# EAGLE design REV1 (EAGLE 9.6.2)
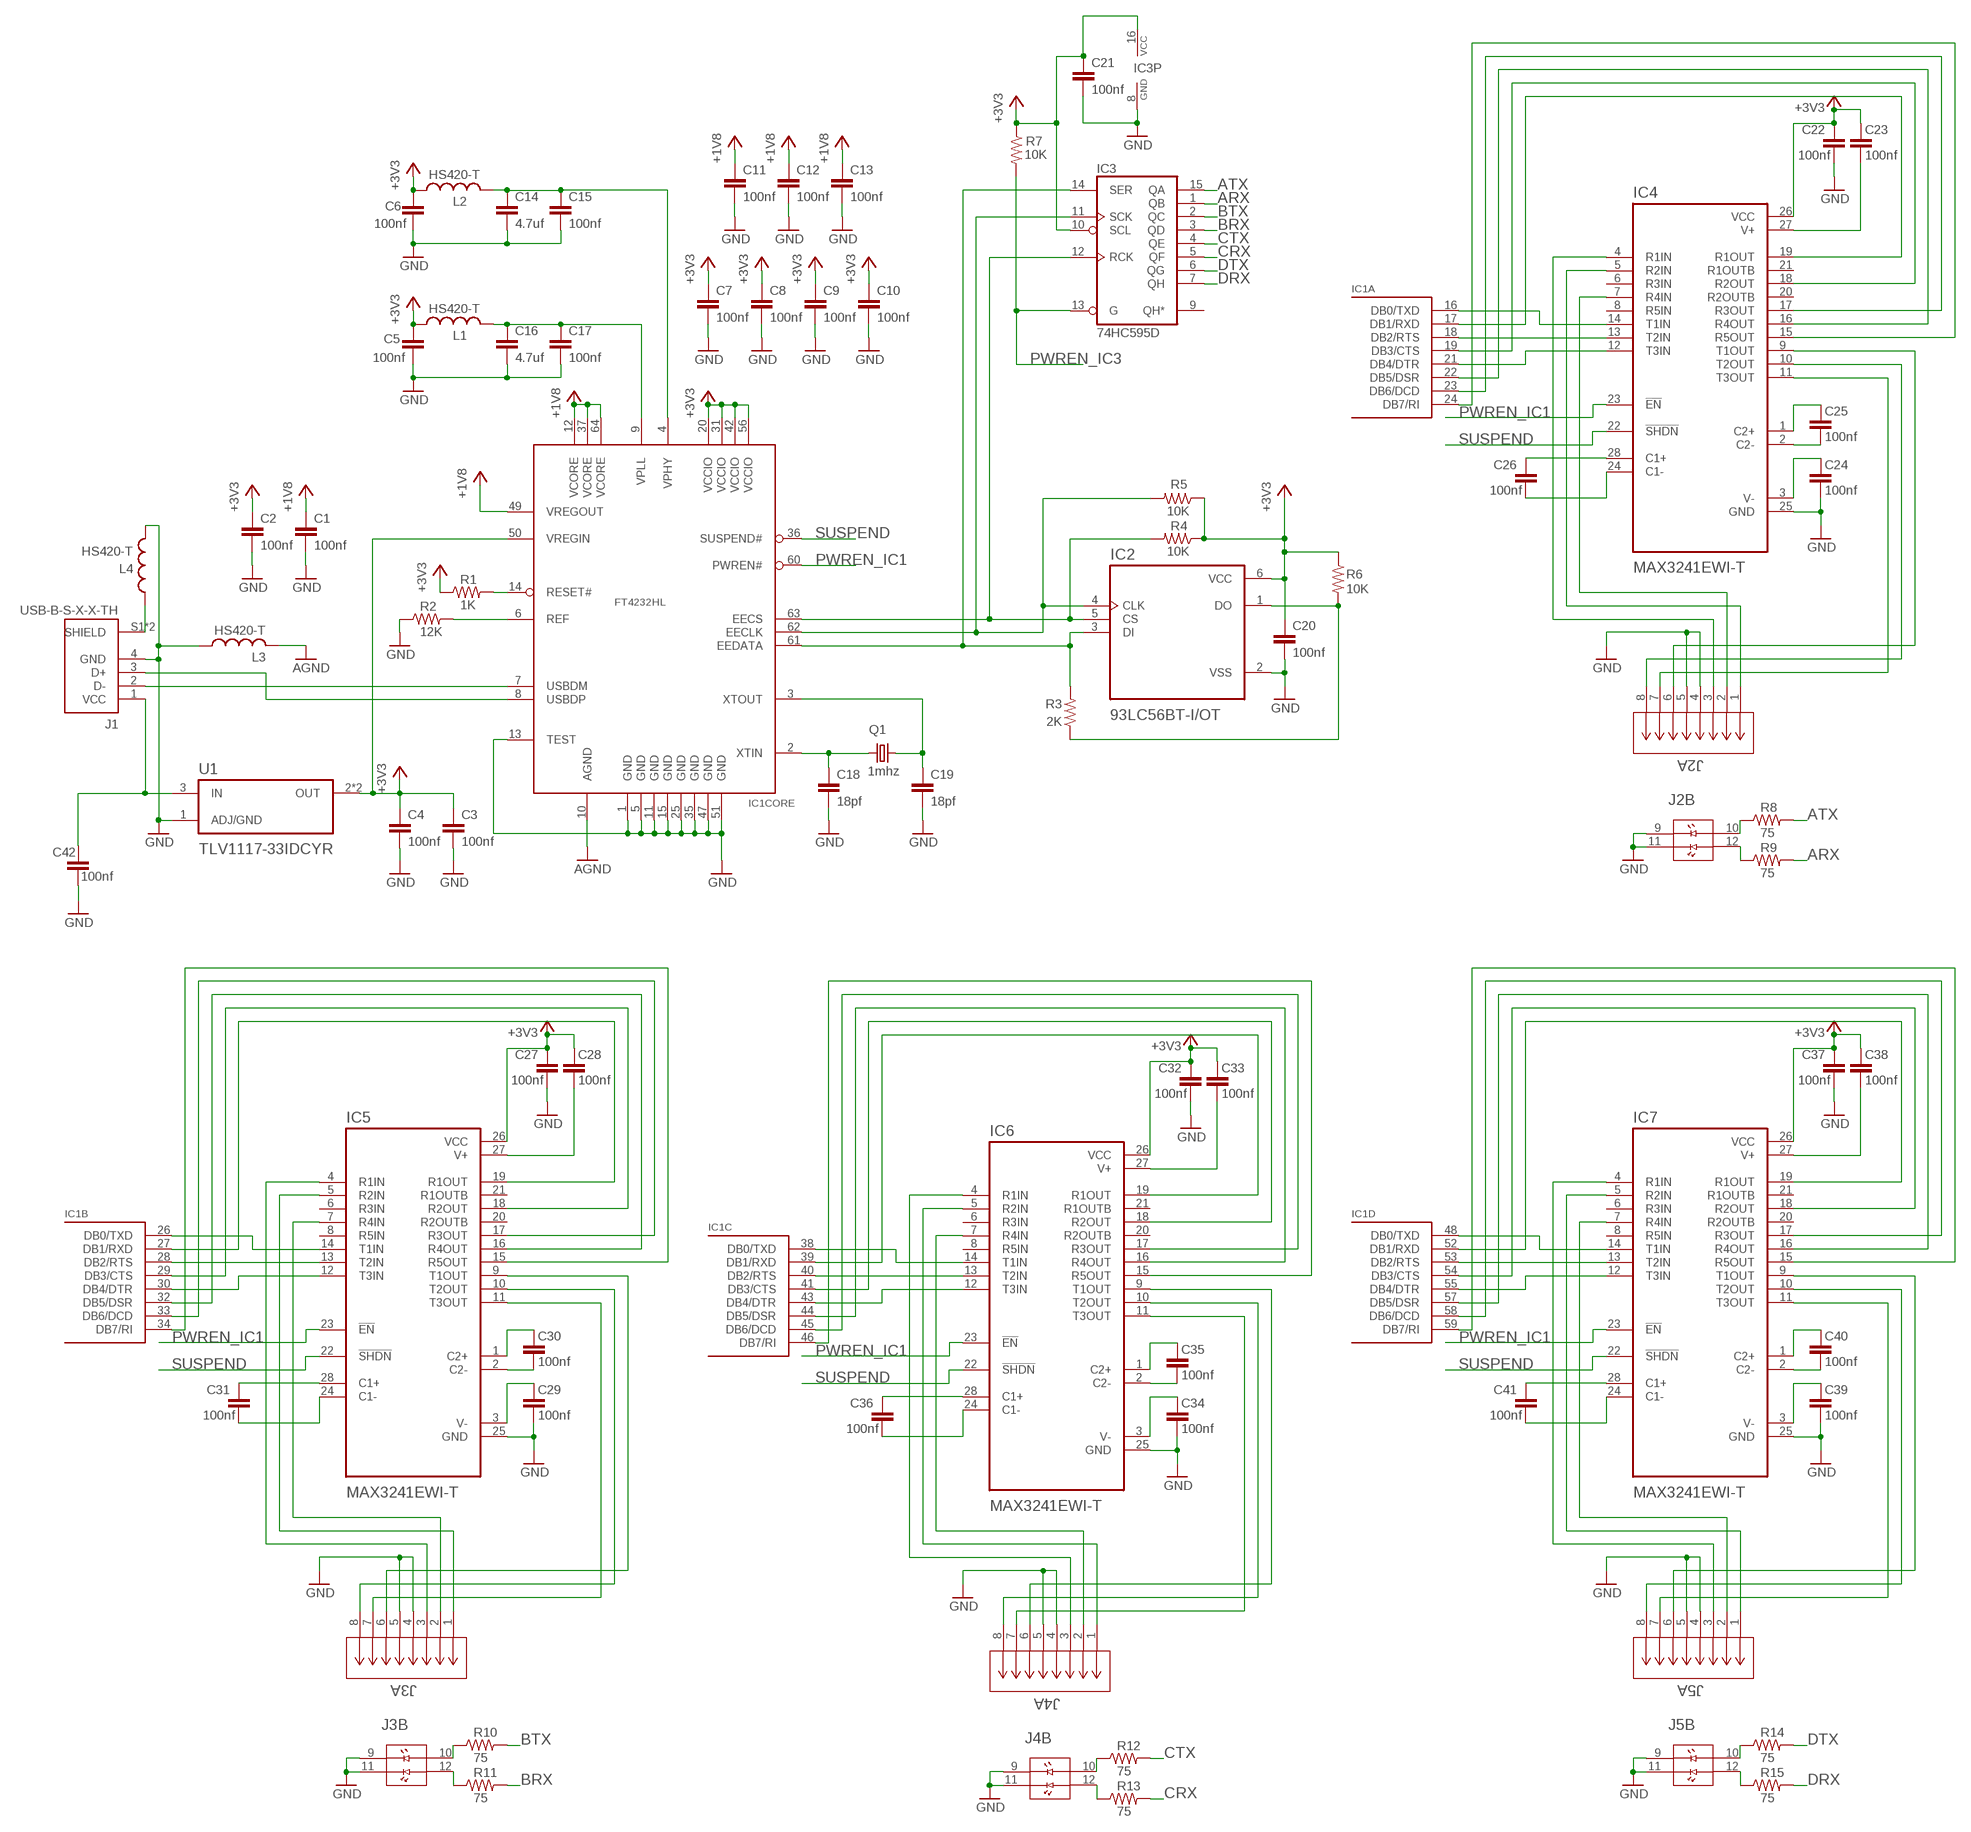
[diagram p0: schematic, sheet 1]

## Parts
C1  100nf  C-EUC0603  [C0603]
C2  100nf  C-EUC0603  [C0603]
C3  100nf  C-EUC0603  [C0603]
C4  100nf  C-EUC0603  [C0603]
C5  100nf  C-EUC0603  [C0603]
C6  100nf  C-EUC0603  [C0603]
C7  100nf  C-EUC0603  [C0603]
C8  100nf  C-EUC0603  [C0603]
C9  100nf  C-EUC0603  [C0603]
C10  100nf  C-EUC0603  [C0603]
C11  100nf  C-EUC0603  [C0603]
C12  100nf  C-EUC0603  [C0603]
C13  100nf  C-EUC0603  [C0603]
C14  4.7uf  C-EUC0603  [C0603]
C15  100nf  C-EUC0603  [C0603]
C16  4.7uf  C-EUC0603  [C0603]
C17  100nf  C-EUC0603  [C0603]
C18  18pf  C-EUC0603  [C0603]
C19  18pf  C-EUC0603  [C0603]
C20  100nf  C-EUC0603  [C0603]
C21  100nf  C-EUC0603  [C0603]
C22  100nf  C-EUC0603  [C0603]
C23  100nf  C-EUC0603  [C0603]
C24  100nf  C-EUC0603  [C0603]
C25  100nf  C-EUC0603  [C0603]
C26  100nf  C-EUC0603  [C0603]
C27  100nf  C-EUC0603  [C0603]
C28  100nf  C-EUC0603  [C0603]
C29  100nf  C-EUC0603  [C0603]
C30  100nf  C-EUC0603  [C0603]
C31  100nf  C-EUC0603  [C0603]
C32  100nf  C-EUC0603  [C0603]
C33  100nf  C-EUC0603  [C0603]
C34  100nf  C-EUC0603  [C0603]
C35  100nf  C-EUC0603  [C0603]
C36  100nf  C-EUC0603  [C0603]
C37  100nf  C-EUC0603  [C0603]
C38  100nf  C-EUC0603  [C0603]
C39  100nf  C-EUC0603  [C0603]
C40  100nf  C-EUC0603  [C0603]
C41  100nf  C-EUC0603  [C0603]
C42  100nf  C-EUC0603  [C0603]
IC1  FT4232HL  [LQFP64]
IC2  93LC56BT-I/OT  [SOT95P280X145-6N]
IC3  74HC595D  [SO16]
IC4  MAX3241EWI-T  [SOIC127P1032X265-28N]
IC5  MAX3241EWI-T  [SOIC127P1032X265-28N]
IC6  MAX3241EWI-T  [SOIC127P1032X265-28N]
IC7  MAX3241EWI-T  [SOIC127P1032X265-28N]
J1  USB-B-S-X-X-TH  [SAMTEC_USB-B-S-X-X-TH]
J2  RJHSE-5384  [RJHSE-5384_AMP]
J3  RJHSE-5384  [RJHSE-5384_AMP]
J4  RJHSE-5384  [RJHSE-5384_AMP]
J5  RJHSE-5384  [RJHSE-5384_AMP]
L1  HS420-T  L-USL2012C  [L2012C]
L2  HS420-T  L-USL2012C  [L2012C]
L3  HS420-T  L-USL2012C  [L2012C]
L4  HS420-T  L-USL2012C  [L2012C]
Q1  1mhz  CRYSTALHC49S  [HC49/S]
R1  1K  R-US_R0805  [R0805]
R2  12K  R-US_R0805  [R0805]
R3  2K  R-US_R0805  [R0805]
R4  10K  R-US_R0805  [R0805]
R5  10K  R-US_R0805  [R0805]
R6  10K  R-US_R0805  [R0805]
R7  10K  R-US_R0805  [R0805]
R8  75  R-US_R0805  [R0805]
R9  75  R-US_R0805  [R0805]
R10  75  R-US_R0805  [R0805]
R11  75  R-US_R0805  [R0805]
R12  75  R-US_R0805  [R0805]
R13  75  R-US_R0805  [R0805]
R14  75  R-US_R0805  [R0805]
R15  75  R-US_R0805  [R0805]
U1  TLV1117-33IDCYR  [SOT230P700X180-4N]

## Nets
+1V8: C1.1 C11.1 C12.1 C13.1 IC1.12(CORE:VCORE) IC1.37(CORE:VCORE) IC1.49(CORE:VREGOUT) IC1.64(CORE:VCORE)
+3V3: C2.1 C3.1 C4.1 C5.1 C6.1 C7.1 C8.1 C9.1 C10.1 C20.1 C21.1 C22.1 C23.1 C27.1 C28.1 C32.1 C33.1 C37.1 C38.1 IC1.20(CORE:VCCIO) IC1.31(CORE:VCCIO) IC1.42(CORE:VCCIO) IC1.50(CORE:VREGIN) IC1.56(CORE:VCCIO) IC2.6(VCC) IC3.10(SCL) IC3.16(VCC) IC4.26(VCC) IC5.26(VCC) IC6.26(VCC) IC7.26(VCC) L1.1 L2.1 R1.1 R4.1 R5.1 R6.1 R7.1 U1.2(OUT) U1.4(OUT)
AGND: IC1.10(CORE:AGND) L3.2
ARX: IC3.1(QB) R9.2
ATX: IC3.15(QA) R8.2
BRX: IC3.3(QD) R11.2
BTX: IC3.2(QC) R10.2
C1+1: C26.1 IC4.28(C1+)
C1+2: C31.1 IC5.28(C1+)
C1+3: C36.1 IC6.28(C1+)
C1+4: C41.1 IC7.28(C1+)
C1-1: C26.2 IC4.24(C1-)
C1-2: C31.2 IC5.24(C1-)
C1-3: C36.2 IC6.24(C1-)
C1-4: C41.2 IC7.24(C1-)
C2+1: C25.1 IC4.1(C2+)
C2+2: C30.1 IC5.1(C2+)
C2+3: C35.1 IC6.1(C2+)
C2+4: C40.1 IC7.1(C2+)
C2-1: C25.2 IC4.2(C2-)
C2-2: C30.2 IC5.2(C2-)
C2-3: C35.2 IC6.2(C2-)
C2-4: C40.2 IC7.2(C2-)
CLKIN: C18.1 IC1.2(CORE:XTIN) Q1.2
CLKOUT: C19.1 IC1.3(CORE:XTOUT) Q1.1
CRX: IC3.5(QF) R13.2
CTS_A: IC4.5(R2IN) J2.1
CTS_A1: IC5.5(R2IN) J3.1
CTS_A2: IC6.5(R2IN) J4.1
CTS_A3: IC7.5(R2IN) J5.1
CTX: IC3.4(QE) R12.2
DO: IC2.1(DO) R3.1 R6.2
DRX: IC3.7(QH) R15.2
DSR_A: IC4.7(R4IN) J2.2
DSR_A1: IC5.7(R4IN) J3.2
DSR_A2: IC6.7(R4IN) J4.2
DSR_A3: IC7.7(R4IN) J5.2
DTR_A: IC4.11(T3OUT) J2.7
DTR_A1: IC5.11(T3OUT) J3.7
DTR_A2: IC6.11(T3OUT) J4.7
DTR_A3: IC7.11(T3OUT) J5.7
DTX: IC3.6(QG) R14.2
EECLK: IC1.62(CORE:EECLK) IC2.4(CLK) IC3.11(SCK) R5.2
EECS: IC1.63(CORE:EECS) IC2.5(CS) IC3.12(RCK) R4.2
EEDATA: IC1.61(CORE:EEDATA) IC2.3(DI) IC3.14(SER) R3.2
GND: C1.2 C2.2 C3.2 C4.2 C5.2 C6.2 C7.2 C8.2 C9.2 C10.2 C11.2 C12.2 C13.2 C14.2 C15.2 C16.2 C17.2 C18.2 C19.2 C20.2 C21.2 C22.2 C24.2 C27.2 C29.2 C32.2 C34.2 C37.2 C39.2 C42.2 IC1.1(CORE:GND) IC1.5(CORE:GND) IC1.11(CORE:GND) IC1.13(CORE:TEST) IC1.15(CORE:GND) IC1.25(CORE:GND) IC1.35(CORE:GND) IC1.47(CORE:GND) IC1.51(CORE:GND) IC2.2(VSS) IC3.8(GND) IC4.25(GND) IC5.25(GND) IC6.25(GND) IC7.25(GND) J1.4(GND) J2.4 J2.5 J2.9 J2.11 J3.4 J3.5 J3.9 J3.11 J4.4 J4.5 J4.9 J4.11 J5.4 J5.5 J5.9 J5.11 L3.1 L4.2 R2.1 U1.1(ADJ/GND)
LED_L1: J2.12 R9.1
LED_L2: J3.12 R11.1
LED_L3: J4.12 R13.1
LED_L4: J5.12 R15.1
LED_R1: J2.10 R8.1
LED_R2: J3.10 R10.1
LED_R3: J4.10 R12.1
LED_R4: J5.10 R14.1
PWREN_IC1: IC1.60(CORE:PWREN#) IC4.23(!EN) IC5.23(!EN) IC6.23(!EN) IC7.23(!EN)
PWREN_IC3: IC3.13(G) R7.2
REF: IC1.6(CORE:REF) R2.2
RESET: IC1.14(CORE:RESET#) R1.2
RTS_A: IC4.10(T2OUT) J2.8
RTS_A1: IC5.10(T2OUT) J3.8
RTS_A2: IC6.10(T2OUT) J4.8
RTS_A3: IC7.10(T2OUT) J5.8
RXD_A: IC4.4(R1IN) J2.3
RXD_A1: IC5.4(R1IN) J3.3
RXD_A2: IC6.4(R1IN) J4.3
RXD_A3: IC7.4(R1IN) J5.3
SUSPEND: IC1.36(CORE:SUSPEND#) IC4.22(!SHDN) IC5.22(!SHDN) IC6.22(!SHDN) IC7.22(!SHDN)
TTL_CTS_A: IC1.19(A:DB3/CTS) IC4.18(R2OUT)
TTL_CTS_A1: IC1.29(B:DB3/CTS) IC5.18(R2OUT)
TTL_CTS_A2: IC1.41(C:DB3/CTS) IC6.18(R2OUT)
TTL_CTS_A3: IC1.54(D:DB3/CTS) IC7.18(R2OUT)
TTL_DCD_A: IC1.23(A:DB6/DCD) IC4.17(R3OUT)
TTL_DCD_A1: IC1.33(B:DB6/DCD) IC5.17(R3OUT)
TTL_DCD_A2: IC1.45(C:DB6/DCD) IC6.17(R3OUT)
TTL_DCD_A3: IC1.58(D:DB6/DCD) IC7.17(R3OUT)
TTL_DSR_A: IC1.22(A:DB5/DSR) IC4.16(R4OUT)
TTL_DSR_A1: IC1.32(B:DB5/DSR) IC5.16(R4OUT)
TTL_DSR_A2: IC1.44(C:DB5/DSR) IC6.16(R4OUT)
TTL_DSR_A3: IC1.57(D:DB5/DSR) IC7.16(R4OUT)
TTL_DTR_A: IC1.21(A:DB4/DTR) IC4.12(T3IN)
TTL_DTR_A1: IC1.30(B:DB4/DTR) IC5.12(T3IN)
TTL_DTR_A2: IC1.43(C:DB4/DTR) IC6.12(T3IN)
TTL_DTR_A3: IC1.55(D:DB4/DTR) IC7.12(T3IN)
TTL_RI_A: IC1.24(A:DB7/RI) IC4.15(R5OUT)
TTL_RI_A1: IC1.34(B:DB7/RI) IC5.15(R5OUT)
TTL_RI_A2: IC1.46(C:DB7/RI) IC6.15(R5OUT)
TTL_RI_A3: IC1.59(D:DB7/RI) IC7.15(R5OUT)
TTL_RTS_A: IC1.18(A:DB2/RTS) IC4.13(T2IN)
TTL_RTS_A1: IC1.28(B:DB2/RTS) IC5.13(T2IN)
TTL_RTS_A2: IC1.40(C:DB2/RTS) IC6.13(T2IN)
TTL_RTS_A3: IC1.53(D:DB2/RTS) IC7.13(T2IN)
TTL_RXD_A: IC1.17(A:DB1/RXD) IC4.19(R1OUT)
TTL_RXD_A1: IC1.27(B:DB1/RXD) IC5.19(R1OUT)
TTL_RXD_A2: IC1.39(C:DB1/RXD) IC6.19(R1OUT)
TTL_RXD_A3: IC1.52(D:DB1/RXD) IC7.19(R1OUT)
TTL_TXD_A: IC1.16(A:DB0/TXD) IC4.14(T1IN)
TTL_TXD_A1: IC1.26(B:DB0/TXD) IC5.14(T1IN)
TTL_TXD_A2: IC1.38(C:DB0/TXD) IC6.14(T1IN)
TTL_TXD_A3: IC1.48(D:DB0/TXD) IC7.14(T1IN)
TXD_A: IC4.9(T1OUT) J2.6
TXD_A1: IC5.9(T1OUT) J3.6
TXD_A2: IC6.9(T1OUT) J4.6
TXD_A3: IC7.9(T1OUT) J5.6
USB5V: C42.1 J1.1(VCC) U1.3(IN)
USBD_N: IC1.7(CORE:USBDM) J1.2(D-)
USBD_P: IC1.8(CORE:USBDP) J1.3(D+)
USBSHLD: J1.S1(SHIELD) J1.S2(SHIELD) L4.1
V+1: C23.2 IC4.27(V+)
V+2: C28.2 IC5.27(V+)
V+3: C33.2 IC6.27(V+)
V+4: C38.2 IC7.27(V+)
V-1: C24.1 IC4.3(V-)
V-2: C29.1 IC5.3(V-)
V-3: C34.1 IC6.3(V-)
V-4: C39.1 IC7.3(V-)
VPHY: C14.1 C15.1 IC1.4(CORE:VPHY) L2.2
VPLL: C16.1 C17.1 IC1.9(CORE:VPLL) L1.2
Unconnected: IC3.9(QH*) IC4.6(R3IN) IC4.8(R5IN) IC4.20(R2OUTB) IC4.21(R1OUTB) IC5.6(R3IN) IC5.8(R5IN) IC5.20(R2OUTB) IC5.21(R1OUTB) IC6.6(R3IN) IC6.8(R5IN) IC6.20(R2OUTB) IC6.21(R1OUTB) IC7.6(R3IN) IC7.8(R5IN) IC7.20(R2OUTB) IC7.21(R1OUTB)

## Library data of the parts
C1-C42 = rcl:C-EU: CAPACITOR, European symbol; SPICEPREFIX: C
IC1 = ftdichip-5:FT4232H: Quad USB UART 5th generation USB to 4-port serial controller
IC2 = 93LC56BT-I_OT:93LC56BT-I/OT; DESCRIPTION: IC EEPROM 2K SPI 2MHZ SOT23-6; MF: Microchip Technology; MP: 93LC56BT-I/OT; PACKAGE: None; PURCHASE-URL: https://pricing.snapeda.com/search/part/93LC56BT-I/OT/?ref=eda
IC3 = 74xx-eu:74*595: 8-bit SHIFT REGISTER, output latch
IC4-IC7 = MAX3241EWI-T:MAX3241EWI-T; DESCRIPTION: 3/5 Transceiver Full RS232 28-SOIC; DIGI-KEY_PART_NUMBER: MAX3241EWI+T-ND; MF: Maxim Integrated; MP: MAX3241EWI+; PACKAGE: SOIC-28 Maxim; PURCHASE-URL: https://pricing.snapeda.com/search/part/MAX3241EWI+/?ref=eda
J1 = USB-B-S-X-X-TH:USB-B-S-X-X-TH: USB-B (USB TYPE-B) USB 2.0 Receptacle Connector 4 Position Through Hole, Right Angle Check prices <https://pricing.snapeda.com/parts/USB-B-S-S-B-TH/Samtec/view-part?ref=eda>; AVAILABILITY: Warning; DESCRIPTION: USB-B (USB TYPE-B) USB 2.0 Receptacle Connector 4 Position Through Hole, Right Angle; MF: Samtec; MP: USB-B-S-S-B-TH; PACKAGE: None; PRICE: None; PURCHASE-URL: https://pricing.snapeda.com/search/part/USB-B-S-S-B-TH/?ref=eda
J2-J5 = On-Hand:RJHSE-5384; BUILT_BY: EMA_Cory; COPYRIGHT: Copyright (C) 2018 Accelerated Designs. All rights reserved; DATASHEET: https://cdn.amphenol-icc.com/media/wysiwyg/files/drawing/rjhsex38x.pdf; MANUFACTURER_PART_NUMBER: RJHSE-5384; SOURCELIBRARY: Amphenol_2020-10-07; VENDOR: Amphenol
L1-L4 = rcl:L-US: INDUCTOR, American symbol; SPICEPREFIX: L
Q1 = crystal:CRYSTAL: CRYSTAL; OC_FARNELL: 1667008; OC_NEWARK: unknown
R1-R15 = rcl:R-US_: RESISTOR, American symbol; SPICEPREFIX: R
U1 = TLV1117-33IDCYR:TLV1117-33IDCYR; DESCRIPTION: 800-mA, 15-V, linear voltage regulator 4-SOT-223 -40 to 125; DIGI-KEY_PART_NUMBER: 296-21113-1-ND; MF: Texas Instruments; MP: TLV1117-33IDCYR; PACKAGE: SOT-223-4 Texas Instruments; PURCHASE-URL: https://pricing.snapeda.com/search/part/TLV1117-33IDCYR/?ref=eda

## Board
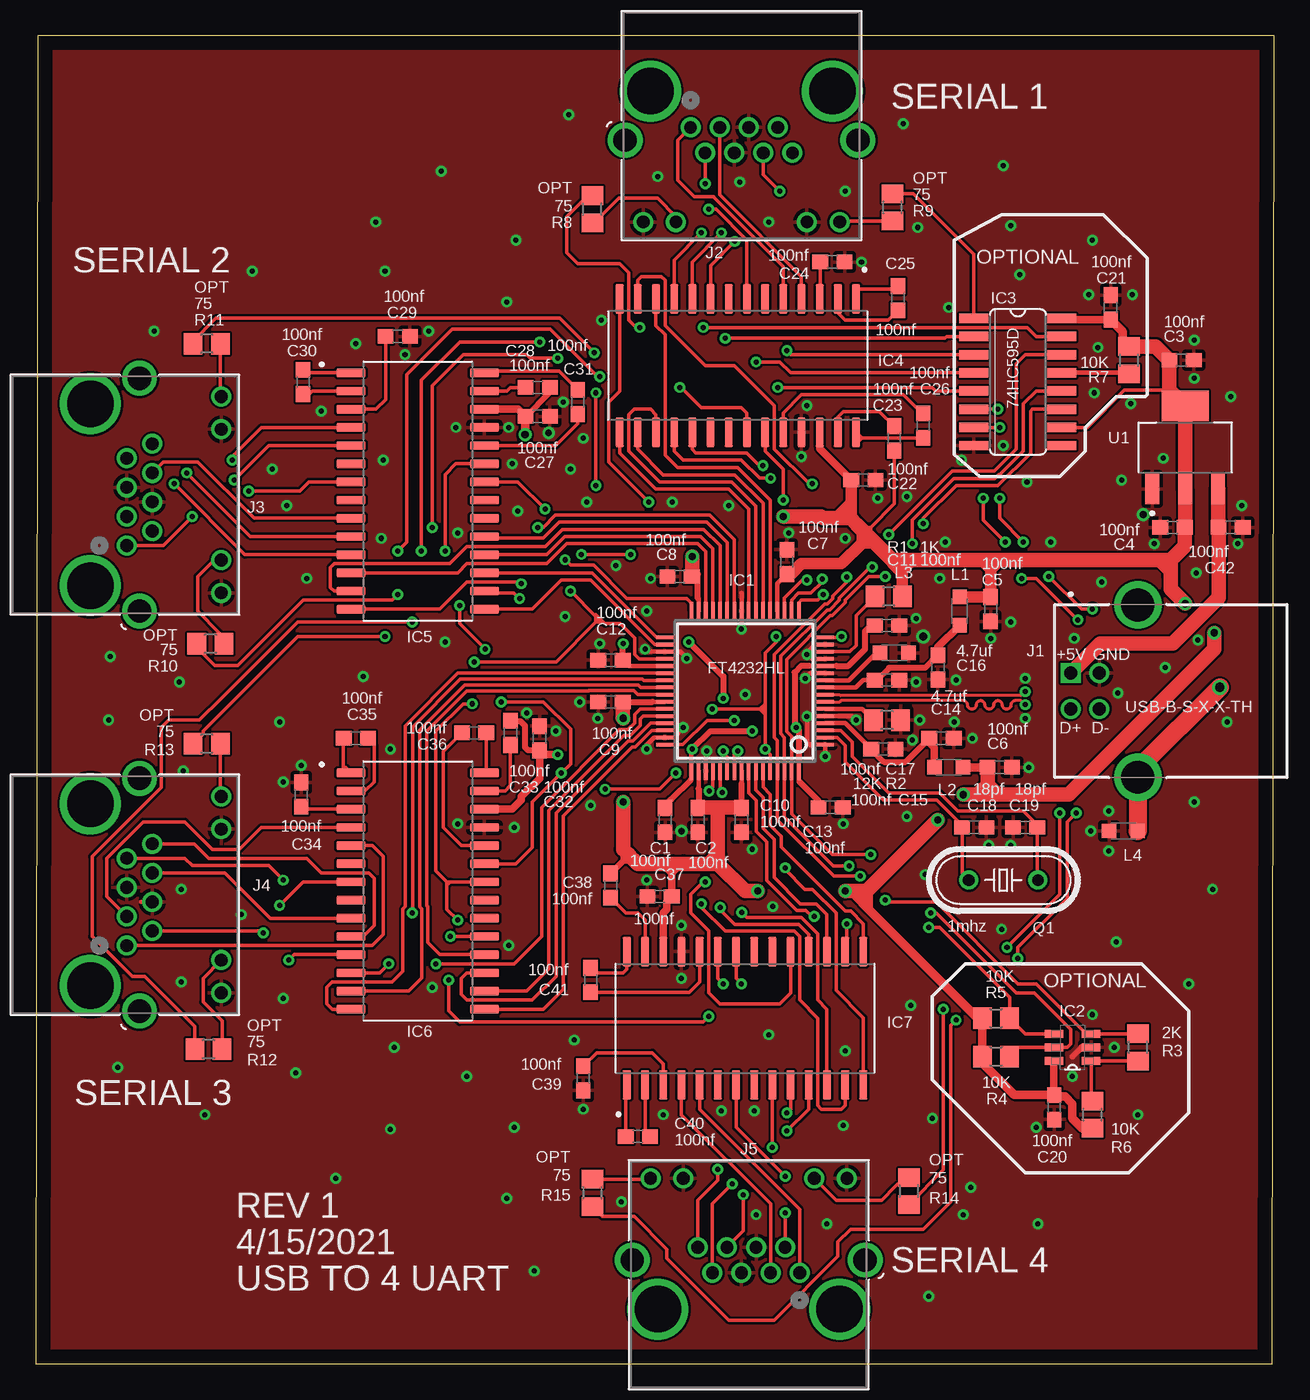
[diagram p1: board, top side]
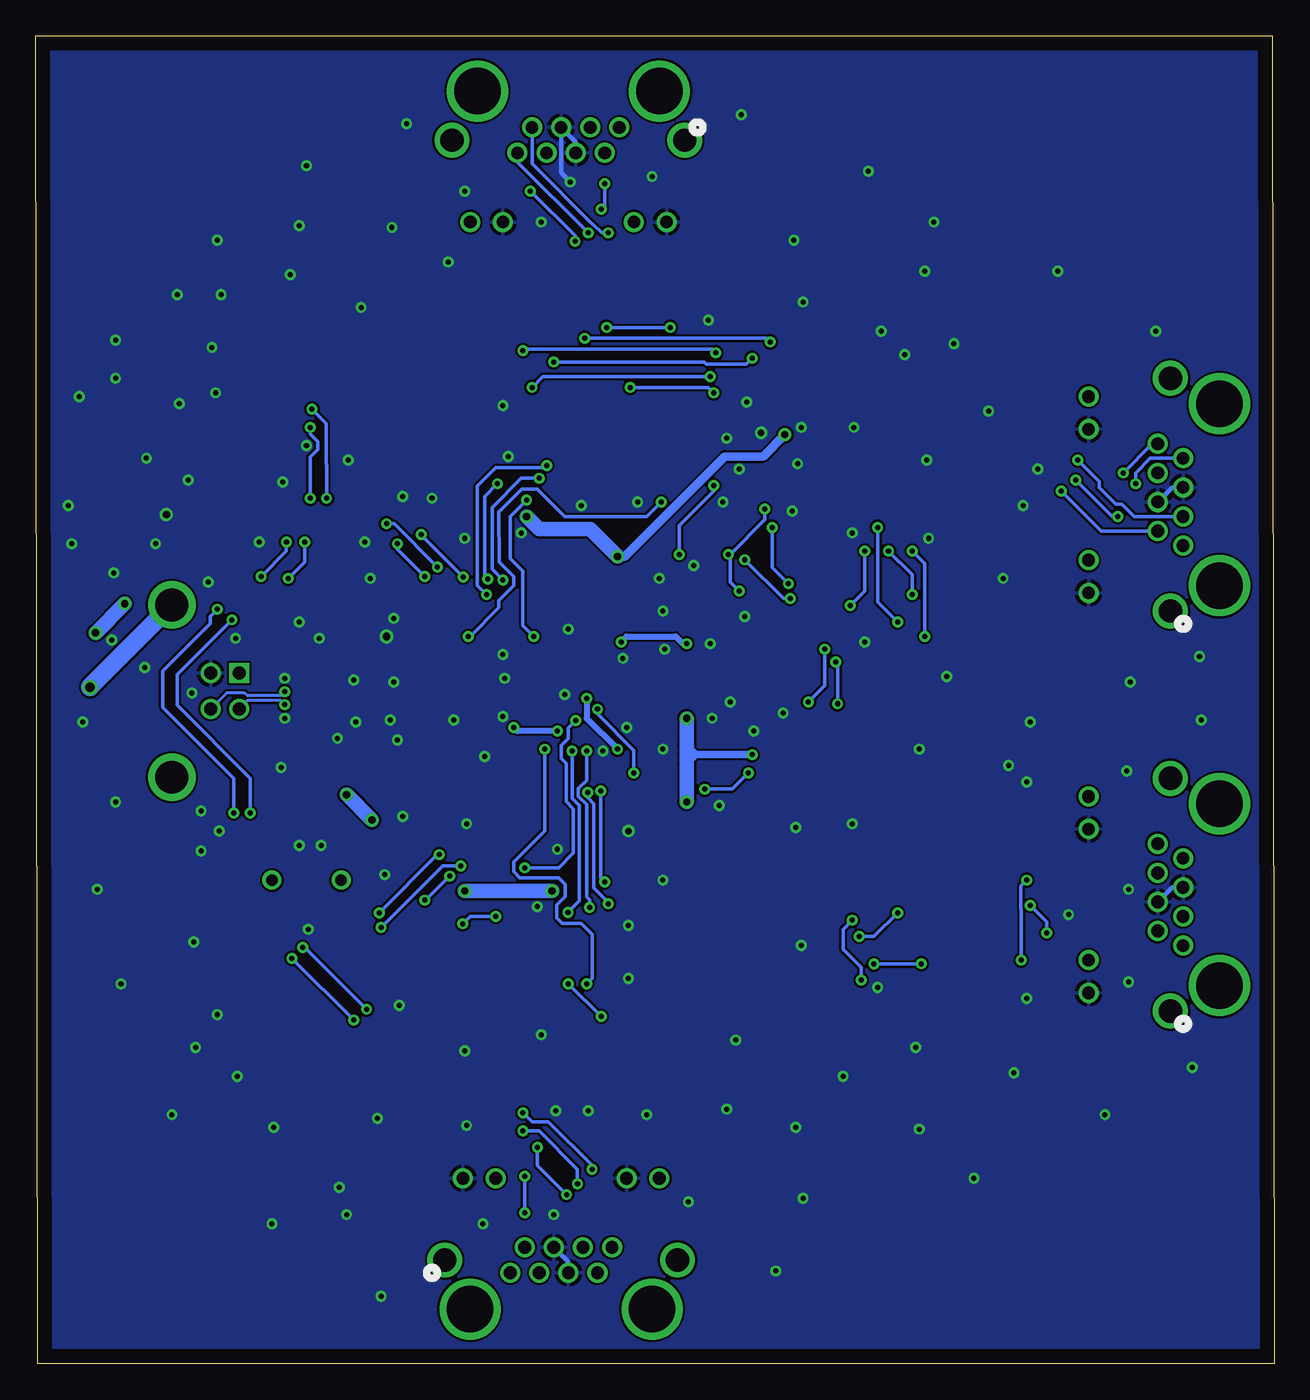
[diagram p2: board, bottom side, seen from below]

Size 86.47 x 92.76 mm. Coordinates in mm from the lower left corner, seen from the top.
Outline: 0,0 86.34,0 86.47,92.76 0.13,92.76 0,0
Copper layers (1*16): Top 0.035mm / dielectric 1.5mm / Bottom 0.035mm
Design rules "default": minimum track width 6mil, minimum drill 0.35mm, track to track 6mil, track to pad 6mil, pad to pad 6mil, via to via 6mil, smd to smd 6mil, copper to edge 40mil, drill to drill 6mil, minimum pad ring 10mil, minimum via ring 8mil, stop-mask expansion 4mil, vias tented up to drill 0mil, thermal gap 10mil

### Footprints (pad centres in the part's own frame; a part is rotated, then mirrored left to right if it is on the bottom)
C0603 = smd 1.1 x 1: 1 -0.85,0; 2 0.85,0
LQFP64 = smd 0.25 x 1.2: 1 -3.75,-5.6; 2 -3.25,-5.6; 3 -2.75,-5.6; 4 -2.25,-5.6; 5 -1.75,-5.6; 6 -1.25,-5.6; 7 -0.75,-5.6; 8 -0.25,-5.6; 9 0.25,-5.6; 10 0.75,-5.6; 11 1.25,-5.6; 12 1.75,-5.6; 13 2.25,-5.6; 14 2.75,-5.6; 15 3.25,-5.6; 16 3.75,-5.6; 33 3.75,5.6; 34 3.25,5.6; 35 2.75,5.6; 36 2.25,5.6; 37 1.75,5.6; 38 1.25,5.6; 39 0.75,5.6; 40 0.25,5.6; 41 -0.25,5.6; 42 -0.75,5.6; 43 -1.25,5.6; 44 -1.75,5.6; 45 -2.25,5.6; 46 -2.75,5.6; 47 -3.25,5.6; 48 -3.75,5.6 | smd 1.2 x 0.25: 17 5.6,-3.75; 18 5.6,-3.25; 19 5.6,-2.75; 20 5.6,-2.25; 21 5.6,-1.75; 22 5.6,-1.25; 23 5.6,-0.75; 24 5.6,-0.25; 25 5.6,0.25; 26 5.6,0.75; 27 5.6,1.25; 28 5.6,1.75; 29 5.6,2.25; 30 5.6,2.75; 31 5.6,3.25; 32 5.6,3.75; 49 -5.6,3.75; 50 -5.6,3.25; 51 -5.6,2.75; 52 -5.6,2.25; 53 -5.6,1.75; 54 -5.6,1.25; 55 -5.6,0.75; 56 -5.6,0.25; 57 -5.6,-0.25; 58 -5.6,-0.75; 59 -5.6,-1.25; 60 -5.6,-1.75; 61 -5.6,-2.25; 62 -5.6,-2.75; 63 -5.6,-3.25; 64 -5.6,-3.75
SOT95P280X145-6N = smd 1.27 x 0.559: 1 -1.295,0.94; 2 -1.295,0; 3 -1.295,-0.94; 4 1.295,-0.94; 5 1.295,0; 6 1.295,0.94
SO16 = smd 0.66 x 2.032: 1 -4.445,-3.073; 2 -3.175,-3.073; 3 -1.905,-3.073; 4 -0.635,-3.073; 5 0.635,-3.073; 6 1.905,-3.073; 7 3.175,-3.073; 8 4.445,-3.073; 9 4.445,3.073; 10 3.175,3.073; 11 1.905,3.073; 12 0.635,3.073; 13 -0.635,3.073; 14 -1.905,3.073; 15 -3.175,3.073; 16 -4.445,3.073
SOIC127P1032X265-28N = smd 2.05 x 0.59: 1 -4.655,8.255; 2 -4.655,6.985; 3 -4.655,5.715; 4 -4.655,4.445; 5 -4.655,3.175; 6 -4.655,1.905; 7 -4.655,0.635; 8 -4.655,-0.635; 9 -4.655,-1.905; 10 -4.655,-3.175; 11 -4.655,-4.445; 12 -4.655,-5.715; 13 -4.655,-6.985; 14 -4.655,-8.255; 15 4.655,-8.255; 16 4.655,-6.985; 17 4.655,-5.715; 18 4.655,-4.445; 19 4.655,-3.175; 20 4.655,-1.905; 21 4.655,-0.635; 22 4.655,0.635; 23 4.655,1.905; 24 4.655,3.175; 25 4.655,4.445; 26 4.655,5.715; 27 4.655,6.985; 28 4.655,8.255
SAMTEC_USB-B-S-X-X-TH = drill 0.9 square: 1 1.25,4.7 | drill 0.9: 2 -1.25,4.7; 3 -1.25,2.7; 4 1.25,2.7 | drill 2.3: S1 -6.02,0; S2 6.02,0
RJHSE-5384_AMP = drill 0.889 pad 1.397: 1 0,0; 2 -1.016,1.778; 3 -2.032,0; 4 -3.048,1.778; 5 -4.064,0; 6 -5.08,1.778; 7 -6.096,0; 8 -7.112,1.778; 9 3.302,6.604; 10 1.016,6.604; 11 -8.128,6.604; 12 -10.414,6.604 | drill 1.626 pad 2.134: 13 -11.684,0.889; 14 4.572,0.889 | drill 3.251 pad 3.251: 15 -9.906,-2.54; 16 2.794,-2.54
L2012C = smd 1 x 1: 1 -1,0; 2 1,0
HC49/S = drill 0.813: 1 -2.413,0; 2 2.413,0
R0805 = smd 1.3 x 1.5: 1 -0.95,0; 2 0.95,0
SOT230P700X180-4N = smd 2.15 x 0.95: 1 -2.9,2.3; 2 -2.9,0; 3 -2.9,-2.3 | smd 2.15 x 3.25: 4 2.9,0

### Placement (x,y rotation side)
C1  43.94,37.97 270 top
C2  46.23,37.97 270 top
C3  80.01,70.1 0 top
C4  79.38,58.42 180 top
C5  66.67,52.71 270 top
C6  67.31,41.66 0 top
C7  52.45,56.01 90 top
C8  44.96,54.99 180 top
C9  40.13,46.23 180 top
C10  49.28,37.97 270 top
C11  59.44,51.56 0 top
C12  40.13,49.15 180 top
C13  55.5,38.86 0 top
C14  63.25,43.69 0 top
C15  59.18,42.93 0 top
C16  62.99,48.64 270 top
C17  59.44,47.75 0 top
C18  65.53,37.47 0 top
C19  69.09,37.47 180 top
C20  71.12,17.91 270 top
C21  75.06,73.79 90 top
C22  57.78,61.72 0 top
C23  59.94,64.64 90 top
C24  55.63,76.96 0 top
C25  60.2,74.42 270 top
C26  61.98,65.53 90 top
C27  35.05,66.17 0 top
C28  35.05,68.2 180 top
C29  25.27,71.75 0 top
C30  18.67,68.58 270 top
C31  37.85,67.18 270 top
C32  35.18,43.69 90 top
C33  33.15,44.07 270 top
C34  18.54,39.75 90 top
C35  22.35,43.69 0 top
C36  30.61,44.07 180 top
C37  43.56,32.64 180 top
C38  40.13,33.4 270 top
C39  38.23,19.94 270 top
C40  42.04,15.88 0 top
C41  38.73,26.8 270 top
C42  83.44,58.42 0 top
IC1  49.53,46.99 90 top
IC2  72.39,22.1 180 top
IC3  68.58,68.58 270 top
IC4  49.02,69.72 270 top
IC5  26.67,60.96 0 top
IC6  26.67,33.02 0 top
IC7  49.53,24.13 90 top
J1  76.96,46.99 90 top
J2  45.72,86.36 180 top
J3  6.35,57.15 270 top
J4  6.35,29.21 270 top
J5  53.34,6.35 0 top
L1  64.52,52.58 270 top
L2  63.75,41.66 180 top
L3  59.94,49.66 180 top
L4  75.95,37.21 180 top
Q1  67.56,33.78 180 top
R1  59.56,53.59 180 top
R2  59.44,44.96 180 top
R3  76.96,22.1 90 top
R4  67.06,21.46 0 top
R5  67.06,24.13 0 top
R6  73.79,17.4 90 top
R7  76.33,70.1 270 top
R8  38.86,80.64 90 top
R9  59.82,80.77 90 top
R10  12.19,50.29 180 top
R11  11.94,71.25 180 top
R12  12.07,21.97 180 top
R13  11.94,43.31 180 top
R14  60.96,12.06 270 top
R15  38.86,11.94 270 top
U1  80.26,64.01 90 top

### Tracks (layer width: path | path; a pad name or v marks a point on that pad's centre or on a via)
+1V8  (via drill 0.35)
  Top 0.254: C1.1 43.94,38.99
  Top 0.305: 58.29,51.56 C11.1 | v45.85,42.93 45.78,42.86 IC1.49 45.78,40.83 45.72,40.77 | 53.28,42.1 IC1.64 53.28,40.7 53.34,40.64 | IC1.37 41.39,48.74 C12.1 | 53.97,48.77 54,48.74 IC1.12 55.91,48.74
  Top 0.406: 58.29,51.56 57.91,51.18 57.91,49.91 56.74,48.74 55.91,48.74 | C11.1 58.67,51.65 | C12.1 40.98,50.25 v41.02,50.29 | v45.59,50.42 48.01,48.01 v48.01,46.48 | v45.85,42.93 47.12,44.2 v50.04,44.2 | 53.28,42.1 53.28,44.26 v53.09,44.45 52.99,44.55 52.99,48.29 53.47,48.77 53.97,48.77 | 45.72,40.77 44.39,39.43 43.94,38.99 | C13.1 54.65,39.33 53.34,40.64
  Bottom 0.406: v45.59,50.42 45.21,50.8 41.78,50.8 41.28,50.29 v41.02,50.29 | v48.01,46.48 48.01,45.09 v45.85,42.93 | v50.04,44.2 52.83,44.2 v53.09,44.45
+3V3  (via drill 0.35, 0.5)
  Top 0.254: IC5.26 31.41,66.59 | C23.1 59.94,60.07 58.29,58.42 | 58.29,58.42 58.29,57.66 58.61,57.34 | 58.29,58.42 57.53,58.42 56.9,59.05 | 33.15,44.87 C33.1 | C38.1 40.13,34.29 | 41.78,35.18 42.04,34.93 | IC3.10 73.41,65.41 76.01,68.01 79.16,68.01
  Top 0.305: IC1.31 46.28,53.41 46.23,53.47 | IC1.20 51.78,54.49 C7.1 | 43.05,46.23 43.18,46.23 43.92,46.23 IC1.42 | IC1.56 49.28,40.52 49.28,40.51 | IC1.50 46.28,40.18
  Top 0.406: 46.23,53.47 46.23,55.16 C8.1 | C9.1 43.05,46.23 | 49.28,40.51 C10.1 | 46.28,40.18 46.28,38.87 46.27,38.86 | C27.1 35.9,67.87 C28.1 | C32.1 34.38,42.84 34.16,43.05 34.16,44.55 33.85,44.87 33.15,44.87 | C38.1 41.04,35.16 | 41.04,35.16 41.4,35.52 41.4,35.56 | 41.04,35.16 41.04,35.92 41.02,35.94 | 41.04,35.16 41.64,35.16 41.72,35.24 | 77.47,56.13 78.1,56.13 79.25,54.99
  Top 0.508: 70.99,21.06 IC2.6 71.09,18.78 C20.1 | C21.1 71.74,72.94 IC3.16 | IC5.26 33.69,66.67 C27.1 34.16,66.13 | C22.1 54.74,63.92 IC4.26 | IC6.26 33.27,38.73 33.91,39.37 33.91,39.62 35.18,40.89 C32.1 35.33,42.69 35.18,42.55 v36.45,42.55 | IC7.26 43.81,31.5 44.07,31.75 44.07,32.3 C37.1 44.41,34.29 | 44.41,34.29 44.41,34.89 44.45,34.93 | 44.41,34.29 45.05,34.93 45.21,34.93 | 44.41,34.29 43.78,34.93 43.69,34.93
  Top 0.61: L2.1 C6.1 | R1.1 60.51,53.87 | 57.15,33.02 57.15,32.77 58.17,31.75 | 58.17,31.75 65.79,24.13 R5.1 R4.1 66.11,21.02 68.34,18.78 71.09,18.78 | 58.04,33.02 58.17,32.89 58.17,31.75 | R6.1 73.09,16.45 72.39,17.14 72.39,18.16 71.88,18.67 71.21,18.67 C20.1 | C21.1 75.9,72.09 75.9,71.48 R7.1 | v34.16,64.9 34.16,66.13
  Top 0.813: R1.1 60.51,56.07 60.45,56.13 | 61.21,56.13 60.51,55.43 60.51,55.25 59.82,55.94 59.82,56.13 | 66.67,55.5 C5.1 64.54,53.55 L1.1 | 66.67,55.5 66.67,56.01 66.55,56.13 | 66.04,56.13 66.67,55.5 | 66.67,55.5 67.31,56.13 | C7.1 52.74,55.16 53.47,55.88 56.26,55.88 57.72,57.34 | 58.17,57.79 57.72,57.34 | 57.72,57.34 57.72,58.23 57.34,58.61 56.94,59.02 56.94,60.11 | 57.72,57.34 58.61,57.34 | 53.34,59.18 53.59,59.18 | 56.94,60.11 C22.1 | 55.88,59.05 56.94,60.11
  Top 1.016: 79.25,56.13 80.22,57.11 C4.1 80.26,58.46 U1.2 U1.4 79.16,68.01 C3.1 78.21,71.05 R7.1 | C6.1 66.46,40.43 | 66.46,40.43 65.79,39.75 | 65.79,39.75 v64.77,39.75 | v62.99,37.97 58.04,33.02 57.15,33.02 v56.52,33.02 | v50.42,33.02 49.53,33.02 47.62,34.93 | 47.62,34.93 47.62,35.56 | 47.62,35.56 47.62,38.86 | 47.62,38.86 49.24,38.86 C10.1 | C2.1 46.27,38.86 47.62,38.86 | v52.2,59.18 53.34,59.18 54.86,59.18 54.99,59.05 55.88,59.05 56.9,59.05 57.34,58.61 58.17,57.79 58.61,57.34 59.82,56.13 60.45,56.13 61.21,56.13 66.04,56.13 66.55,56.13 67.31,56.13 77.47,56.13 79.25,56.13 | v45.85,56.39 45.85,55.03 C8.1 | C9.1 40.98,45.12 v41.02,45.09 | 79.25,56.13 79.25,54.99 79.25,54.1 v80.26,53.09 | v82.3,51.05 82.3,49.91 72.14,39.75 67.13,39.75 | 67.13,39.75 65.79,39.75 | 66.46,40.43 67.13,39.75 | v41.02,39.24 41.02,35.94 41.4,35.56 41.72,35.24 42.04,34.93 43.69,34.93 44.45,34.93 45.21,34.93 46.99,34.93 | 46.99,34.93 47.62,34.93 | 46.99,34.93 47.62,35.56
  Bottom 0.508: v45.85,56.39 45.34,56.39 | v36.45,42.55 40.39,42.55 | 40.39,42.55 41.02,42.55 | 41.02,43.18 40.39,42.55 | 41.02,41.91 40.39,42.55
  Bottom 0.61: 45.34,56.39 38.35,63.37 35.69,63.37 v34.16,64.9
  Bottom 1.016: v64.77,39.75 v62.99,37.97 | v56.52,33.02 v50.42,33.02 | v52.2,59.18 51.31,58.29 47.75,58.29 v45.85,56.39 | v41.02,45.09 41.02,43.18 41.02,42.55 41.02,41.91 v41.02,39.24 | v80.26,53.09 v82.3,51.05
AGND
  Top 0.305: IC1.10 56.77,47.74 58.69,49.66 L3.2
ARX
  Top 0.254: IC3.1 65.51,77.49 61.28,81.72 R9.2
ATX  (via drill 0.35)
  Top 0.254: IC3.15 69.85,71.75 69.24,72.36 46.63,72.36 v46.61,72.39 | v42.16,72.39 42.04,72.26 41.4,72.9 41.4,76.2 40.77,76.83 37.85,76.83 37.08,77.6 37.08,80.14 38.54,81.59 R8.2
  Bottom 0.254: v46.61,72.39 v42.16,72.39
BRX  (via drill 0.35)
  Top 0.254: IC3.3 52.73,70.48 v52.45,70.76 | v38.99,70.61 36.58,73.02 12.57,73.02 10.99,71.44 R11.2
  Bottom 0.254: v38.99,70.61 39.24,70.87 52.35,70.87 v52.45,70.76
BTX  (via drill 0.35)
  Top 0.254: IC3.2 63.6,71.75 63.47,71.63 v48.13,71.63 | v35.18,71.37 29.59,71.37 26.92,68.71 v26.92,56.77 | v25.27,53.72 24.89,53.34 18.67,53.34 14.1,48.77 12.51,48.77 11.24,50.04 R10.2
  Bottom 0.254: v48.13,71.63 35.43,71.63 v35.18,71.37 | v26.92,56.77 25.27,55.12 v25.27,53.72
C1+1
  Top 0.254: C26.1 61.94,64.64 57.7,64.64 | 57.7,64.64 IC4.28 | 57.7,64.64 57.66,64.64 57.28,64.26
C1+2
  Top 0.254: C31.1 36.54,69.34 31.45,69.34 IC5.28
C1+3
  Top 0.254: C36.1 31.46,41.41 IC6.28
C1+4
  Top 0.254: IC7.28 41.28,27.56 41.02,27.3 39.08,27.3 C41.1
C1-1
  Top 0.254: C26.2 61.89,66.38 60.58,67.69 53.47,67.69 52.2,66.42 IC4.24
C1-2
  Top 0.254: C31.2 37.85,65.66 36.32,64.13 IC5.24
C1-3
  Top 0.254: C36.2 28.45,42.76 28.45,37.47 29.72,36.2 IC6.24
C1-4
  Top 0.254: C41.2 45.63,25.95 46.35,26.67 IC7.24
C2+1
  Top 0.254: C25.1 59.98,75.06 57.4,75.06 57.28,74.93 IC4.1
C2+2
  Top 0.254: C30.1 18.88,69.21 IC5.1
C2+3
  Top 0.254: IC6.1 21.63,41.66 21.46,41.66 21.46,43.65 C35.1
C2+4
  Top 0.254: C40.1 41.19,19.39 IC7.1
C2-1
  Top 0.254: C25.2 59.52,72.9 56.52,72.9 56.01,73.41 IC4.2
C2-2
  Top 0.254: C30.2 19.09,67.73 19.3,67.94 IC5.2
C2-3
  Top 0.254: C35.2 23.62,43.27 23.62,40.64 22.99,40.01 IC6.2
C2-4
  Top 0.254: IC7.2 42.55,16.22 C40.2
CLKIN
  Top 0.254: Q1.2 64.68,34.25 C18.1 64.68,37.59 62.9,39.37 59.18,39.37 56.52,42.04 56.52,43.18 55.95,43.74 IC1.2
CLKOUT
  Top 0.254: Q1.1 69.94,33.82 C19.1 69.94,37.63 68.96,38.61 64.39,38.61 63.12,39.88 59.56,39.88 57.02,42.42 57.02,43.43 56.22,44.24 IC1.3
CRX  (via drill 0.35)
  Top 0.254: R13.2 11.68,44 11.68,44.2 18.29,50.8 v24.38,50.8 | v25.27,56.77 25.91,57.4 25.91,69.09 29.08,72.26 35.94,72.26 39.24,68.96 v39.37,68.96 | IC3.5 62.84,67.94 62.59,68.2 v51.82,68.2
  Bottom 0.254: v24.38,50.8 24.38,55.88 v25.27,56.77 | v39.37,68.96 51.05,68.96 v51.82,68.2
CTS_A
  Top 0.254: IC4.5 52.2,76.64 47.35,81.49 47.35,81.53 45.97,81.53 44.83,82.68 44.83,85.47 J2.1
CTS_A1  (via drill 0.35)
  Top 0.254: IC5.5 16.26,64.13 v13.84,61.72 | v10.92,59.18 8.89,57.15 J3.1
  Bottom 0.254: v13.84,61.72 11.3,59.18 v10.92,59.18
CTS_A2
  Top 0.254: J4.1 23.5,29.21 24.26,29.97 24.26,35.43 23.5,36.2 IC6.5
CTS_A3
  Top 0.254: IC7.5 46.35,17.78 53.34,10.79 J5.1
CTX  (via drill 0.35)
  Top 0.254: IC3.4 52.7,69.21 51.94,69.98 v50.29,69.98 | v36.45,70.23 34.54,70.23 34.29,70.48 29.85,70.48 27.69,68.33 v27.69,58.42 | v26.29,51.82 18.29,51.82 13.08,46.61 12.95,46.48 11.43,44.96 9.27,44.96 8.76,44.45 8.76,40.26 3.94,35.43 3.94,29.85 6.73,27.05 7.62,27.05 11.11,23.56 R12.2
  Bottom 0.254: v50.29,69.98 39.79,69.98 39.64,69.83 36.85,69.83 v36.45,70.23 | v27.69,58.42 27.69,53.21 v26.29,51.82
DO
  Top 0.254: R6.2 73.69,18.45 IC2.1 R3.1
DRX  (via drill 0.35)
  Top 0.254: R15.2 39.56,10.29 41.78,10.29 44.07,8 44.07,7.37 48.39,3.05 51.56,3.05 56.01,7.49 56.01,8.51 56.9,9.4 61.98,9.4 63.88,11.3 63.88,23.62 v64.26,24 | v68.58,28.32 68.58,29.08 72.01,32.51 72.01,37.85 v72.64,38.48 | v73.79,52.71 73.02,52.71 v70.74,54.99 | v68.96,57.4 67.31,59.05 v67.31,60.45 | v67.31,65.41 IC3.7
  Bottom 0.254: v64.26,24 v68.58,28.32 | v72.64,38.48 72.64,40.89 77.6,45.85 77.6,48.39 74.3,51.69 74.3,52.2 v73.79,52.71 | v70.74,54.99 68.96,56.77 v68.96,57.4 | v67.31,60.45 67.31,63.33 66.78,63.86 66.78,64.41 67.31,64.94 v67.31,65.41
DSR_A  (via drill 0.35)
  Top 0.254: IC4.7 49.66,78.49 47.5,80.64 v46.99,80.64 | v46.74,82.42 J2.2
  Bottom 0.254: v46.99,80.64 46.74,80.9 v46.74,82.42
DSR_A1  (via drill 0.35)
  Top 0.254: IC5.7 19.05,61.6 18.42,60.96 v14.86,60.96
  Bottom 0.254: v14.86,60.96 12.07,58.17 J3.2
DSR_A2  (via drill 0.35)
  Top 0.254: J4.2 15.75,30.23 v15.88,30.1 | v17.02,32 18.67,33.66 IC6.7
  Bottom 0.254: v15.88,30.1 15.88,30.86 v17.02,32
DSR_A3  (via drill 0.35)
  Top 0.254: J5.2 v52.32,10.54 | v52.32,13.08 48.89,16.51 IC7.7
  Bottom 0.254: v52.32,10.54 v52.32,13.08
DTR_A  (via drill 0.35)
  Top 0.254: IC4.11 44.58,77.09 v46.48,78.99
  Bottom 0.254: v46.48,78.99 46.95,78.99 47.61,79.65 47.65,79.65 51.82,83.82 J2.7
DTR_A1  (via drill 0.35)
  Top 0.254: IC5.11 14.61,56.52 v9.65,61.47
  Bottom 0.254: v9.65,61.47 9.65,62.23 8.64,63.25 J3.7
DTR_A2  (via drill 0.35)
  Top 0.254: J4.7 10.41,35.31 10.92,34.8 16.26,34.8 v17.27,33.78 | v17.65,28.19 18.03,28.57 IC6.11
  Bottom 0.254: v17.65,28.19 17.65,31.71 17.68,31.73 17.68,33.38 v17.27,33.78
DTR_A3  (via drill 0.35)
  Top 0.254: J5.7 47.24,11.18 v48.64,12.57 | v52.45,16.26 53.97,17.78 IC7.11
  Bottom 0.254: v48.64,12.57 48.64,13.59 51.31,16.26 v52.45,16.26
DTX  (via drill 0.35)
  Top 0.254: R14.2 63.37,13.53 v63.37,24.76 | v67.82,29.08 71.5,32.77 v71.5,38.48 | v72.77,51.96 69.87,54.86 v68.83,54.86 | v67.69,57.4 66.17,58.93 v66.17,60.45 | v67.18,66.67 IC3.6
  Bottom 0.254: v63.37,24.76 67.69,29.08 v67.82,29.08 | v71.5,38.48 71.5,40.89 76.6,46 76.6,48.15 73.04,51.71 73.02,51.71 v72.77,51.96 | v68.83,54.86 67.69,56.01 v67.69,57.4 | v66.17,60.45 66.17,62.82 66.19,62.85 66.19,65.68 v67.18,66.67
EECLK  (via drill 0.35)
  Top 0.254: v56.79,34.78 55.7,34.78 52.28,38.2 IC1.62 52.28,43.75 52.02,44.01 52.02,49.42 55.26,52.66 55.43,52.66 56.11,53.33 56.11,53.5 58.25,55.65 v58.42,55.65 | v62.36,30.48 63.12,30.48 68.01,25.59 R5.2 69.1,23.04 IC2.4 | v61.98,58.67 61.98,59.05 64.26,61.34 67.18,61.34 69.47,63.63 69.47,66.55 69.6,66.67 IC3.11
  Bottom 0.254: v56.79,34.78 58.06,34.78 v62.36,30.48 | v58.42,55.65 61.44,58.67 v61.98,58.67
EECS  (via drill 0.35)
  Top 0.254: v58.29,35.56 55.63,35.56 52.78,38.41 IC1.63 52.78,43.83 52.43,44.18 52.43,49.2 55.48,52.25 55.6,52.25 56.52,53.17 56.52,53.33 58.17,54.99 v59.31,54.99 | v62.48,31.5 62.86,31.5 68.45,25.91 69.72,25.91 72.26,23.37 72.26,22.35 72.01,22.1 IC2.5 68.64,22.1 R4.2 | v61.21,57.28 61.21,58.93 64.11,61.82 66.97,61.82 67.25,62.1 67.31,62.1 68.96,63.75 68.96,67.06 69.85,67.94 IC3.12
  Bottom 0.254: v58.29,35.56 58.42,35.56 v62.48,31.5 | v59.31,54.99 61.21,56.9 v61.21,57.28
EEDATA  (via drill 0.35)
  Top 0.254: v57.57,34.06 55.71,34.06 51.78,37.99 IC1.61 51.78,43.55 51.58,43.75 51.58,49.55 55.09,53.06 55.26,53.06 55.65,53.45 55.65,53.62 56.62,54.59 v56.62,54.94 | v59.31,32.39 59.44,32.26 62.86,32.26 68.58,26.54 69.85,26.54 73.35,23.04 IC2.3 76.95,23.04 R3.2 | v59.56,57.91 64.01,62.36 66.93,62.36 68.45,63.88 68.45,69.85 69.09,70.48 IC3.14
  Bottom 0.254: v57.57,34.06 59.24,32.39 v59.31,32.39 | v56.62,54.94 59.56,57.89 v59.56,57.91
GND  (via drill 0.35, 0.45, 0.5, 0.55)
  Top 0.305: v42.67,42.93 42.67,43.23 43.18,43.74 IC1.47 44.59,43.74 44.83,43.99 44.83,44.07 v45.21,44.45 | IC1.51 46.78,42.72 v46.86,42.8 | 49.28,53.85 49.28,53.84 IC1.25 v49.28,51.31 | IC1.15 54.43,50.24 53.85,49.66 | 53.85,49.66 v53.85,49.53 | IC1.13 54.27,49.24 53.85,49.66 | IC1.11 54.08,48.24 v53.72,47.88 | 53.88,45.24 IC1.5 56.99,45.24 v57.28,44.96 | 53.88,45.24 v53.85,45.21 | v42.55,49.91 42.72,49.74 IC1.35 45,49.74 v45.47,49.28 | v55.12,42.42 v55.13,42.43 IC1.1 54.16,43.24 54.1,43.18 53.88,43.41 53.88,45.24 | J4.4 7.37,32.26
  Top 0.406: IC2.2 73.02,22.1 72.39,21.46
  Bottom 0.305: v49.15,82.55 49.78,83.19 J2.5 48.77,85.34 J2.4 | J3.5 7.11,61.21 J3.4 | J4.4 7.11,33.27 J4.5 | J5.4 49.28,7.11 J5.5
  other vias: 61.47,52.07 61.98,50.8 61.47,47.62 61.21,43.56 64.13,44.83 69.34,41.66 66.55,36.2 68.07,36.2 66.67,50.67 75.56,46.86 73.66,37.21 39.37,50.29 39.24,45.09 42.93,54.86 58.8,60.45 56.39,37.72 50.04,35.94 75.31,22.1 69.85,16.51 45.08,37.21 77.34,59.31 83.95,57.28 78.1,57.28 80.9,68.83 78.74,63.25 63.5,57.4 69.09,47.88 69.09,45.09 40.51,55.75 56.52,57.66 62.1,34.16 38.73,38.99 42.67,33.78 51.46,31.93 52.58,58.04 37.59,22.61 24.76,42.93 36.96,52.2 37.34,62.48 33.02,65.41 27.43,72.14 35.81,65.02 57.66,76.96 33.4,37.47 18.54,41.78 38.23,17.78 53.47,63.37 28.57,50.42 38.23,64.64 48.39,59.94 42.67,52.58 36.32,44.2 45.08,30.61 64.77,10.41 45.08,26.92 27.69,26.29 33.02,29.21 29.46,37.72 29.34,65.41 25.78,70.48 36.83,67.18 17.27,40.64 34.29,45.47 37.97,46.23 49.53,46.74 60.83,38.23 61.72,44.96 64.26,47.75 68.07,51.82 70.87,57.4 64.64,63.12 53.85,66.93 51.18,79.76 74.93,38.61 74.93,35.81 65.41,43.69 63.12,54.86 60.83,60.58 44.45,60.2 38.48,60.2 33.66,59.56 29.46,58.04 24.13,57.66 16.51,62.48 17.53,59.94 18.92,54.86 10.29,41.4 14.35,31.37 10.16,33.15 10.16,26.67 43.81,17.4 47.88,17.65 50.16,17.65 56.52,21.84 51.18,22.99 55.24,9.78 50.29,10.41 40.89,11.3 72.39,20.07 73.79,24.38 83.19,44.83 81.03,55.25 73.91,67.82 76.45,67.06 74.17,70.99 73.53,74.68 76.58,74.68 80.9,71.5 84.2,59.94 74.42,54.61 65.28,12.32 56.39,16.64 18.16,20.32 32.89,11.56 30.1,20.07 11.81,17.4 5.71,20.7 20.96,12.95 34.8,6.48 24.76,16.38 33.4,16.51 25.02,22.1 17.27,25.53 10.03,47.62 5.21,49.4 5.08,44.96 17.02,44.83 22.86,48.01 24.26,63.12 33.27,62.87 37.21,87.25 28.32,83.31 33.53,78.49 23.75,79.76 15.11,76.33 8.25,72.14 22.35,71.25 19.94,66.55 24.38,76.33 39.5,72.9 32.89,74.17 43.43,82.93 56.52,81.91 60.58,86.61 67.56,83.69 73.79,78.49 68.07,79.5 68.71,76.07 63.75,73.79 61.59,79.38 75.82,61.72 69.22,61.6 80.9,39.24 75.44,29.46 67.44,30.35 61.09,25.02 62.61,17.14 62.36,4.7 69.98,9.78 76.96,17.4 80.52,26.54 82.17,33.15 83.44,67.56 72.52,50.67 81.15,50.55 67.56,64.13 78.87,48.64
  pour Top: -17.78,78.74 -17.78,8.89 0,-8.89 82.55,-8.89 97.79,6.35 97.79,90.17 90.51,97.45 0.93,97.45
  pour Bottom: -17.78,78.74 -17.78,8.89 0,-8.89 82.55,-8.89 97.79,6.35 97.79,90.17 90.55,97.41 0.89,97.41
LED_L1
  Top 0.254: R9.1 56.2,79.82 J2.12
LED_L2
  Top 0.254: R11.1 12.89,67.63 J3.12
LED_L3
  Top 0.254: R13.1 12.89,39.69 J4.12
LED_L4
  Top 0.254: J5.12 42.86,12.89 R15.1
LED_R1
  Top 0.254: R8.1 38.99,79.69 40.7,81.41 43.43,81.41 44.7,80.14 J2.10
LED_R2
  Top 0.254: R10.1 12.83,50.61 12.83,51.05 11.3,52.58 11.3,54.99 12.45,56.13 J3.10
LED_R3
  Top 0.254: J4.10 11.68,26.92 11.68,25.27 13.01,23.94 R12.1
LED_R4
  Top 0.254: J5.10 55.88,11.43 59.05,11.43 60.01,12.38 60.45,12.83 60.64,13.02 R14.1
PWREN_IC1  (via drill 0.35)
  Top 0.254: IC4.23 50.93,63.75 52.2,62.48 v52.2,60.32 | v51.69,50.8 51.69,50.42 50.93,49.66 50.93,46.1 | IC1.60 51.28,42.57 v50.93,42.93 50.93,45.34 | 50.93,45.34 50.93,45.72 | v48.01,26.54 47.62,26.92 IC7.23 | v44.7,41.28 43.56,40.13 v39.75,40.13 | IC6.23 33.53,34.93 34.67,36.07 34.67,39.24 v36.7,41.28 37.34,41.91 37.34,44.32 35.43,46.23 v32.51,46.23 | 50.93,46.1 50.93,45.72 | v31.37,49.91 29.59,51.69 v29.59,52.96 | v28.57,56.77 28.57,62.1 29.34,62.87 IC5.23 | v47.24,45.72 49.53,45.72 50.55,45.72 | 50.55,45.72 50.93,45.72 | 50.93,46.1 50.55,45.72 | 50.55,45.72 50.93,45.34
  Bottom 0.254: v52.2,60.32 53.34,59.18 53.34,56.26 52.45,55.37 52.45,51.56 v51.69,50.8 | v50.93,42.93 50.93,37.23 53.11,35.05 53.11,34.38 52.67,33.93 49.97,33.93 49.5,33.47 49.5,32.63 50.09,32.05 50.09,31.12 49.7,30.74 48.39,30.74 47.62,29.97 47.62,26.92 v48.01,26.54 | v44.7,41.28 44.7,42.84 47.24,45.38 v47.24,45.72 | v39.75,40.13 37.85,40.13 v36.7,41.28 | v32.51,46.23 31.37,47.37 v31.37,49.91 | v29.59,52.96 28.57,53.98 v28.57,56.77
PWREN_IC3
  Top 0.305: R7.2 76.27,69.21 IC3.13
REF
  Top 0.305: IC1.6 57.7,45.74 R2.2
RESET
  Top 0.254: IC1.14 56.85,49.74 57.28,50.16 57.28,52.26 R1.2
RTS_A  (via drill 0.35)
  Top 0.254: IC4.10 45.85,76.96 v47.88,78.99
  Bottom 0.254: v47.88,78.99 52.83,83.95 J2.8
RTS_A1  (via drill 0.35)
  Top 0.254: IC5.10 14.99,57.79 v10.54,62.23
  Bottom 0.254: v10.54,62.23 8.51,64.26 J3.8
RTS_A2
  Top 0.254: J4.8 11.05,36.32 12.07,35.31 18.92,35.31 19.94,34.29 23.24,34.29 23.62,33.91 23.62,30.61 22.86,29.85 IC6.10
RTS_A3  (via drill 0.35)
  Top 0.254: IC7.10 52.7,17.78 v52.45,17.53 | v47.62,13.59 47.62,12.83 46.23,11.43 J5.8
  Bottom 0.254: v52.45,17.53 51.82,16.89 50.67,16.89 47.62,13.84 v47.62,13.59
RXD_A
  Top 0.254: IC4.4 53.47,75.95 47.75,81.66 J2.3
RXD_A1  (via drill 0.35)
  Top 0.254: IC5.4 15.75,65.41 13.72,63.37 v13.72,63.12
  Bottom 0.254: J3.3 9.78,59.18 10.64,60.05 11.07,60.05 12.21,61.2 12.21,61.62 v13.72,63.12
RXD_A2
  Top 0.254: IC6.4 15.75,37.47 14.22,35.94 12.32,35.94 10.41,37.85 7.49,37.85 4.95,35.31 4.95,32.64 J4.3
RXD_A3
  Top 0.254: IC7.4 45.08,17.4 51.31,11.18 J5.3
SUSPEND  (via drill 0.35)
  Top 0.254: IC1.36 42.13,49.24 41.81,49.56 41.81,50.69 40.81,51.69 39.75,51.69 39.62,51.82 | 39.37,52.07 39.12,52.32 39.12,52.2 | 39.37,52.07 39.62,51.82 | v41.53,56.52 41.51,56.54 v38.1,56.54 | IC4.22 49.66,66.42 49.28,66.8 46.48,66.8 45.08,68.2 v44.96,68.2 | v35.56,59.69 33.66,61.6 IC5.22 | 39.37,52.07 39.12,51.82 | 39.12,51.82 36.33,49.03 v30.61,49.03 v30.61,49.02 | v30.48,46.1 29.85,46.1 27.94,44.2 27.94,34.42 28.7,33.66 | 28.7,33.66 28.96,33.66 | 28.96,33.66 IC6.22 | IC7.22 48.89,26.92 v49.28,26.54 | v46.99,24.26 46.61,23.88 29.59,23.88 28.83,24.64 v28.83,26.8 | v29.46,30.99 28.7,31.75 28.7,33.4 | 28.7,33.4 28.7,33.66 | 28.7,33.4 28.96,33.66 | v39.12,61.34 v39.12,67.82 | v37.34,53.98 39.12,52.2 | 39.12,52.2 39.12,51.82 | 39.12,51.82 39.62,51.82
  Bottom 0.254: v37.34,53.98 37.97,54.61 37.97,56.41 v38.1,56.54 37.97,56.54 35.56,58.95 v35.56,59.69 | v41.53,56.52 41.53,58.55 39.12,60.96 v39.12,61.34 | v30.61,49.02 30.48,48.9 v30.48,46.1 | v49.28,26.54 v46.99,24.26 | v28.83,26.8 28.83,27.69 30.1,28.96 30.1,30.35 v29.46,30.99 | v39.12,67.82 39.5,68.2 v44.96,68.2
TTL_CTS_A  (via drill 0.35)
  Top 0.254: IC1.19 52.28,53.5 53.52,54.74 v53.85,54.74 | v51.31,61.85 50.55,61.85 49.26,63.13 45.2,63.13 44.58,63.75 IC4.18
  Bottom 0.254: v53.85,54.74 54.61,55.5 54.61,59.82 52.58,61.85 v51.31,61.85
TTL_CTS_A1
  Top 0.254: IC1.29 47.28,56.93 46.44,57.78 36.95,57.78 35.69,56.52 IC5.18
TTL_CTS_A2
  Top 0.254: IC1.41 42.04,46.74 41.77,47.02 38.62,47.02 38.6,46.99 30.1,46.99 27.31,44.2 27.31,31.98 27.35,31.94 27.35,29.42 28.19,28.57 IC6.18
TTL_CTS_A3  (via drill 0.35)
  Top 0.254: IC1.54 48.28,42.4 48.01,42.67 v48.01,42.8 | v47.8,31.88 47.8,31.71 48.82,30.68 53.26,30.68 53.97,29.97 IC7.18
  Bottom 0.254: v48.01,42.8 48.01,40.75 48.58,40.17 48.58,39.62 48.01,39.05 48.01,32.59 47.8,32.39 v47.8,31.88
TTL_DCD_A
  Top 0.254: IC1.23 50.28,59.9 48.59,61.59 43.57,61.59 41.4,63.75 41.4,66.29 41.78,66.67 42.93,66.67 43.31,66.29 IC4.17
TTL_DCD_A1
  Top 0.254: IC1.33 43.37,50.74 38.86,55.25 IC5.17
TTL_DCD_A2
  Top 0.254: IC1.45 42.94,44.74 41.68,43.48 41.36,43.48 36.33,38.46 36.33,27.06 34.67,25.4 30.1,25.4 29.72,25.78 29.72,26.92 30.1,27.3 IC6.17
TTL_DCD_A3
  Top 0.254: IC1.58 50.28,40.07 50.79,39.56 50.79,37.4 51.55,36.64 51.55,33.97 53.39,32.13 54.48,32.13 55.24,31.37 IC7.17
TTL_DSR_A
  Top 0.254: IC1.22 50.78,60.11 48.8,62.09 43.83,62.09 42.04,63.88 IC4.16
TTL_DSR_A1  (via drill 0.35)
  Top 0.254: IC1.32 45.78,53.15 45.47,53.47 41.28,53.47 38.97,55.78 37.34,55.78 v36.96,56.16 | v33.78,53.44 33.38,53.85 31.45,53.85 IC5.16
  Bottom 0.254: v36.96,56.16 34.25,53.44 v33.78,53.44
TTL_DSR_A2
  Top 0.254: IC1.44 42.41,45.24 42.22,45.05 42.22,44.59 41.52,43.89 41.06,43.89 35.83,38.66 35.83,27.57 34.29,26.04 IC6.16
TTL_DSR_A3  (via drill 0.35)
  Top 0.254: IC1.57 49.78,39.87 50.29,39.35 50.29,37.19 51.05,36.43 51.05,33.77 53.14,31.68 53.78,31.68 54.22,31.24 v54.36,31.24 | v56.64,30.73 56.64,28.91 IC7.16
  Bottom 0.254: v54.36,31.24 56.13,31.24 v56.64,30.73
TTL_DTR_A
  Top 0.254: IC1.21 51.28,60.32 49.01,62.59 44.83,62.59 43.94,63.48 43.94,71.88 43.31,72.52 IC4.12
TTL_DTR_A1
  Top 0.254: IC1.30 46.78,56.73 46.23,57.28 37.08,57.28 35.69,55.88 30.1,55.88 29.46,55.25 IC5.12
TTL_DTR_A2  (via drill 0.35)
  Top 0.254: IC1.43 42.2,45.74 41.81,45.35 41.81,44.76 41.35,44.3 40.76,44.3 35.33,38.87 35.33,29.85 33.4,27.92 v27.94,27.92 | v24.64,27.94 24,27.3 IC6.12
  Bottom 0.254: v27.94,27.92 27.92,27.94 v24.64,27.94
TTL_DTR_A3  (via drill 0.35)
  Top 0.254: IC1.55 48.78,42.56 v49.02,42.8 | v49.3,31.52 49.64,31.19 53.46,31.19 54.61,30.04 54.61,25.4 55.24,24.76 IC7.12
  Bottom 0.254: v49.02,42.8 49.02,39.49 48.51,38.98 48.51,32.34 49.3,31.55 v49.3,31.52
TTL_RI_A
  Top 0.254: IC1.24 49.78,59.69 48.39,61.09 43.31,61.09 40.77,63.63 IC4.15
TTL_RI_A1
  Top 0.254: IC1.34 43.23,50.24 38.73,54.74 36.7,54.74 34.67,52.71 IC5.15
TTL_RI_A2
  Top 0.254: IC1.46 43.01,44.24 41.85,43.08 41.66,43.08 36.83,38.25 36.83,26.16 35.43,24.76 IC6.15
TTL_RI_A3
  Top 0.254: IC1.59 50.78,40.28 51.29,39.77 51.29,37.61 52.05,36.85 52.05,36.08 56.52,31.62 56.9,31.62 57.78,30.73 IC7.15
TTL_RTS_A  (via drill 0.35)
  Top 0.254: IC1.18 52.78,53.35 53.25,53.83 54.12,53.83 54.91,54.61 v54.91,54.82 | IC4.13 42.04,75.69 42.29,75.95 43.69,75.95 43.94,75.69 43.94,72.52 46.74,69.72 48.77,69.72 51.56,66.93 51.56,63.9 53.99,61.47 v54.23,61.47
  Bottom 0.254: v54.91,54.82 55.12,55.03 55.12,60.58 v54.23,61.47
TTL_RTS_A1
  Top 0.254: IC1.28 47.78,57.14 46.64,58.28 36.75,58.28 35.56,57.09 30.1,57.09 28.89,55.88 20.83,55.88 20.57,55.63 20.57,54.23 20.83,53.98 IC5.13
TTL_RTS_A2
  Top 0.254: IC1.40 42.24,47.24 42.06,47.42 29.95,47.42 26.81,44.28 26.81,31.91 26.95,31.77 26.95,26.95 26.04,26.04 IC6.13
TTL_RTS_A3  (via drill 0.35)
  Top 0.254: IC1.53 47.78,40.04 v47.92,39.9 | v46.48,32.13 46.48,31.88 48.13,30.23 52.96,30.23 53.34,29.85 53.34,25.4 54.61,24.13 54.61,18.03 54.86,17.78 56.26,17.78 56.52,18.03 IC7.13
  Bottom 0.254: v47.92,39.9 47.92,39.54 47.5,39.12 47.5,33.23 46.48,32.22 v46.48,32.13
TTL_RXD_A  (via drill 0.35)
  Top 0.254: IC1.17 53.28,53.15 53.47,53.34 54.61,53.34 v54.99,53.72 | v50.78,62.74 50.52,62.74 49.63,63.63 46.1,63.63 45.85,63.88 IC4.19
  Bottom 0.254: v54.99,53.72 55.63,54.36 55.63,61.32 54.33,62.61 50.9,62.61 v50.78,62.74
TTL_RXD_A1
  Top 0.254: IC1.27 48.28,57.35 46.85,58.78 36.55,58.78 35.43,57.66 31.45,57.66 IC5.19
TTL_RXD_A2  (via drill 0.35)
  Top 0.254: IC1.39 42.45,47.74 42.36,47.83 29.65,47.83 26.31,44.48 26.31,31.51 v26.29,31.5 | v28.96,29.85 IC6.19
  Bottom 0.254: v26.29,31.5 27.94,29.85 v28.96,29.85
TTL_RXD_A3  (via drill 0.35)
  Top 0.254: IC1.52 47.28,40.27 v47.01,40.01 | v46.74,33.66 46.61,33.66 45.72,32.77 45.72,31.5 46.99,30.23 46.99,25.91 47.75,25.15 51.94,25.15 52.7,25.91 IC7.19
  Bottom 0.254: v47.01,40.01 47.01,33.93 v46.74,33.66
TTL_TXD_A  (via drill 0.35)
  Top 0.254: v42.8,60.2 40,62.99 40,67.18 40.77,67.94 IC4.14 | v56.26,50.8 56.2,50.74 IC1.16
  Bottom 0.254: v56.26,50.8 56.13,50.8 54.12,52.81 54.12,53.32 53.09,54.36 53.09,54.99 54.1,56.01 54.13,59.51 52.55,61.09 51.44,61.09 49.53,59.18 43.81,59.18 v42.8,60.2
TTL_TXD_A1  (via drill 0.35)
  Top 0.254: IC1.26 48.78,57.55 47.06,59.28 36.29,59.28 35.43,58.42 v35.05,58.42 | v33.91,54.48 33.78,54.61 30.1,54.61 28.19,52.71 IC5.14
  Bottom 0.254: v35.05,58.42 35.05,55.63 v33.91,54.48
TTL_TXD_A2
  Top 0.254: IC1.38 29.48,48.24 25.81,44.56 25.81,31.94 25.63,31.77 25.63,27.41 24.89,26.67 20.7,26.67 20.32,26.29 20.32,25.15 20.7,24.76 IC6.14
TTL_TXD_A3  (via drill 0.35)
  Top 0.254: IC1.48 45.19,43.24 46.88,44.93 v48.77,44.93 | 52.32,34.52 53.7,33.15 54.23,33.15 55.88,31.5 55.88,26.08 57.78,24.17 IC7.14
  Top 0.305: v52.32,34.65 52.32,34.52
  Bottom 0.254: v48.77,44.93 49.28,44.42 49.28,43.69 49.78,43.18 49.78,42.29 49.43,41.94 49.43,39.27 48.92,38.76 48.92,35.66 49.94,34.65 v52.32,34.65
TXD_A  (via drill 0.35)
  Top 0.254: IC4.9 47.12,76.71 v48.81,78.4 | v51.94,81.91 50.8,83.06 J2.6
  Bottom 0.254: v51.94,81.91 48.81,78.78 v48.81,78.4
TXD_A1
  Top 0.254: J3.6 8.89,62.99 11.3,62.99 15.24,59.05 IC5.9
TXD_A2
  Top 0.254: J4.6 13.21,34.29 16.38,31.11 IC6.9
TXD_A3  (via drill 0.35)
  Top 0.254: IC7.9 v51.44,15.11 | v49.4,11.81 49.4,9.27 J5.6
  Bottom 0.254: v51.44,15.11 51.44,13.84 v49.4,11.81
USB5V
  Top 1.016: J1.1 74.31,50.29 79.38,50.29 82.59,53.51 C42.1 82.56,58.45 U1.3
USBD_N  (via drill 0.35)
  Top 0.203: IC1.7 56.14,46.24 56.21,46.31 64.77,46.31 arc-90 65.06,46.02 arc90 65.35,45.73 65.38,45.73 arc90 65.67,46.02 arc-90 65.96,46.31 65.98,46.31 arc-90 66.27,46.02 arc90 66.57,45.73 66.59,45.73 arc90 66.88,46.02 arc-90 67.17,46.31 67.19,46.31 arc-90 67.49,46.02 arc90 67.78,45.73 67.8,45.73 arc90 68.09,46.02 arc-90 68.39,46.31 68.81,46.31 v69.09,46.04
  Bottom 0.203: v69.09,46.04 69.36,46.31 71.69,46.31 J1.2
USBD_P  (via drill 0.35)
  Top 0.203: IC1.8 56.14,46.74 56.21,46.67 68.81,46.67 v69.09,46.94
  Bottom 0.203: v69.09,46.94 69.36,46.67 71.69,46.67 71.88,46.86 73.14,46.86 J1.3
USBSHLD  (via drill 0.65)
  Top 1.27: v82.68,47.24 76.96,41.53 J1.S1 76.96,37.23 L4.1
  Bottom 1.27: J1.S2 82.68,47.3 v82.68,47.24
V+1
  Top 0.254: IC4.27 56.01,66.14 56.39,66.52 58.91,66.52 C23.2
V+2
  Top 0.254: IC5.27 32.89,67.94 33.15,68.2 C28.2
V+3
  Top 0.254: C33.2 33.15,40.39 32.77,40.01 IC6.27
V+4
  Top 0.254: C38.2 41.19,31.5 42.04,31.5 42.55,30.99 IC7.27
V-1
  Top 0.254: C24.1 54.78,74.42 IC4.3
V-2
  Top 0.254: C29.1 24.42,67.35 23.75,66.67 IC5.3
V-3
  Top 0.254: C34.1 18.71,38.73 IC6.3
V-4
  Top 0.254: C39.1 39.16,21.72 43.05,21.72 43.81,20.95 IC7.3
VPHY
  Top 0.305: IC1.4 56.52,44.74 C15.1
  Top 0.406: C15.1 59.22,42.04 60.74,42.04 C14.1
  Top 0.508: C14.1 62.4,43.4 62.75,43.04 L2.2
VPLL
  Top 0.305: IC1.9 57.27,47.24 57.78,47.75 C17.1
  Top 0.406: C16.1 62.11,48.61 59.59,48.61 58.73,47.75 C17.1
  Top 0.508: L1.2 62.99,50.05 C16.1

### Text on the board
tNames: SERIAL 1 | OPT | OPT | SERIAL 2 | OPTIONAL | OPT | OPT | +5V | GND | OPT | D+ | D- | OPTIONAL | OPT | SERIAL 3 | OPT | OPT | REV 1 | 4/15/2021 | SERIAL 4 | USB TO 4 UART